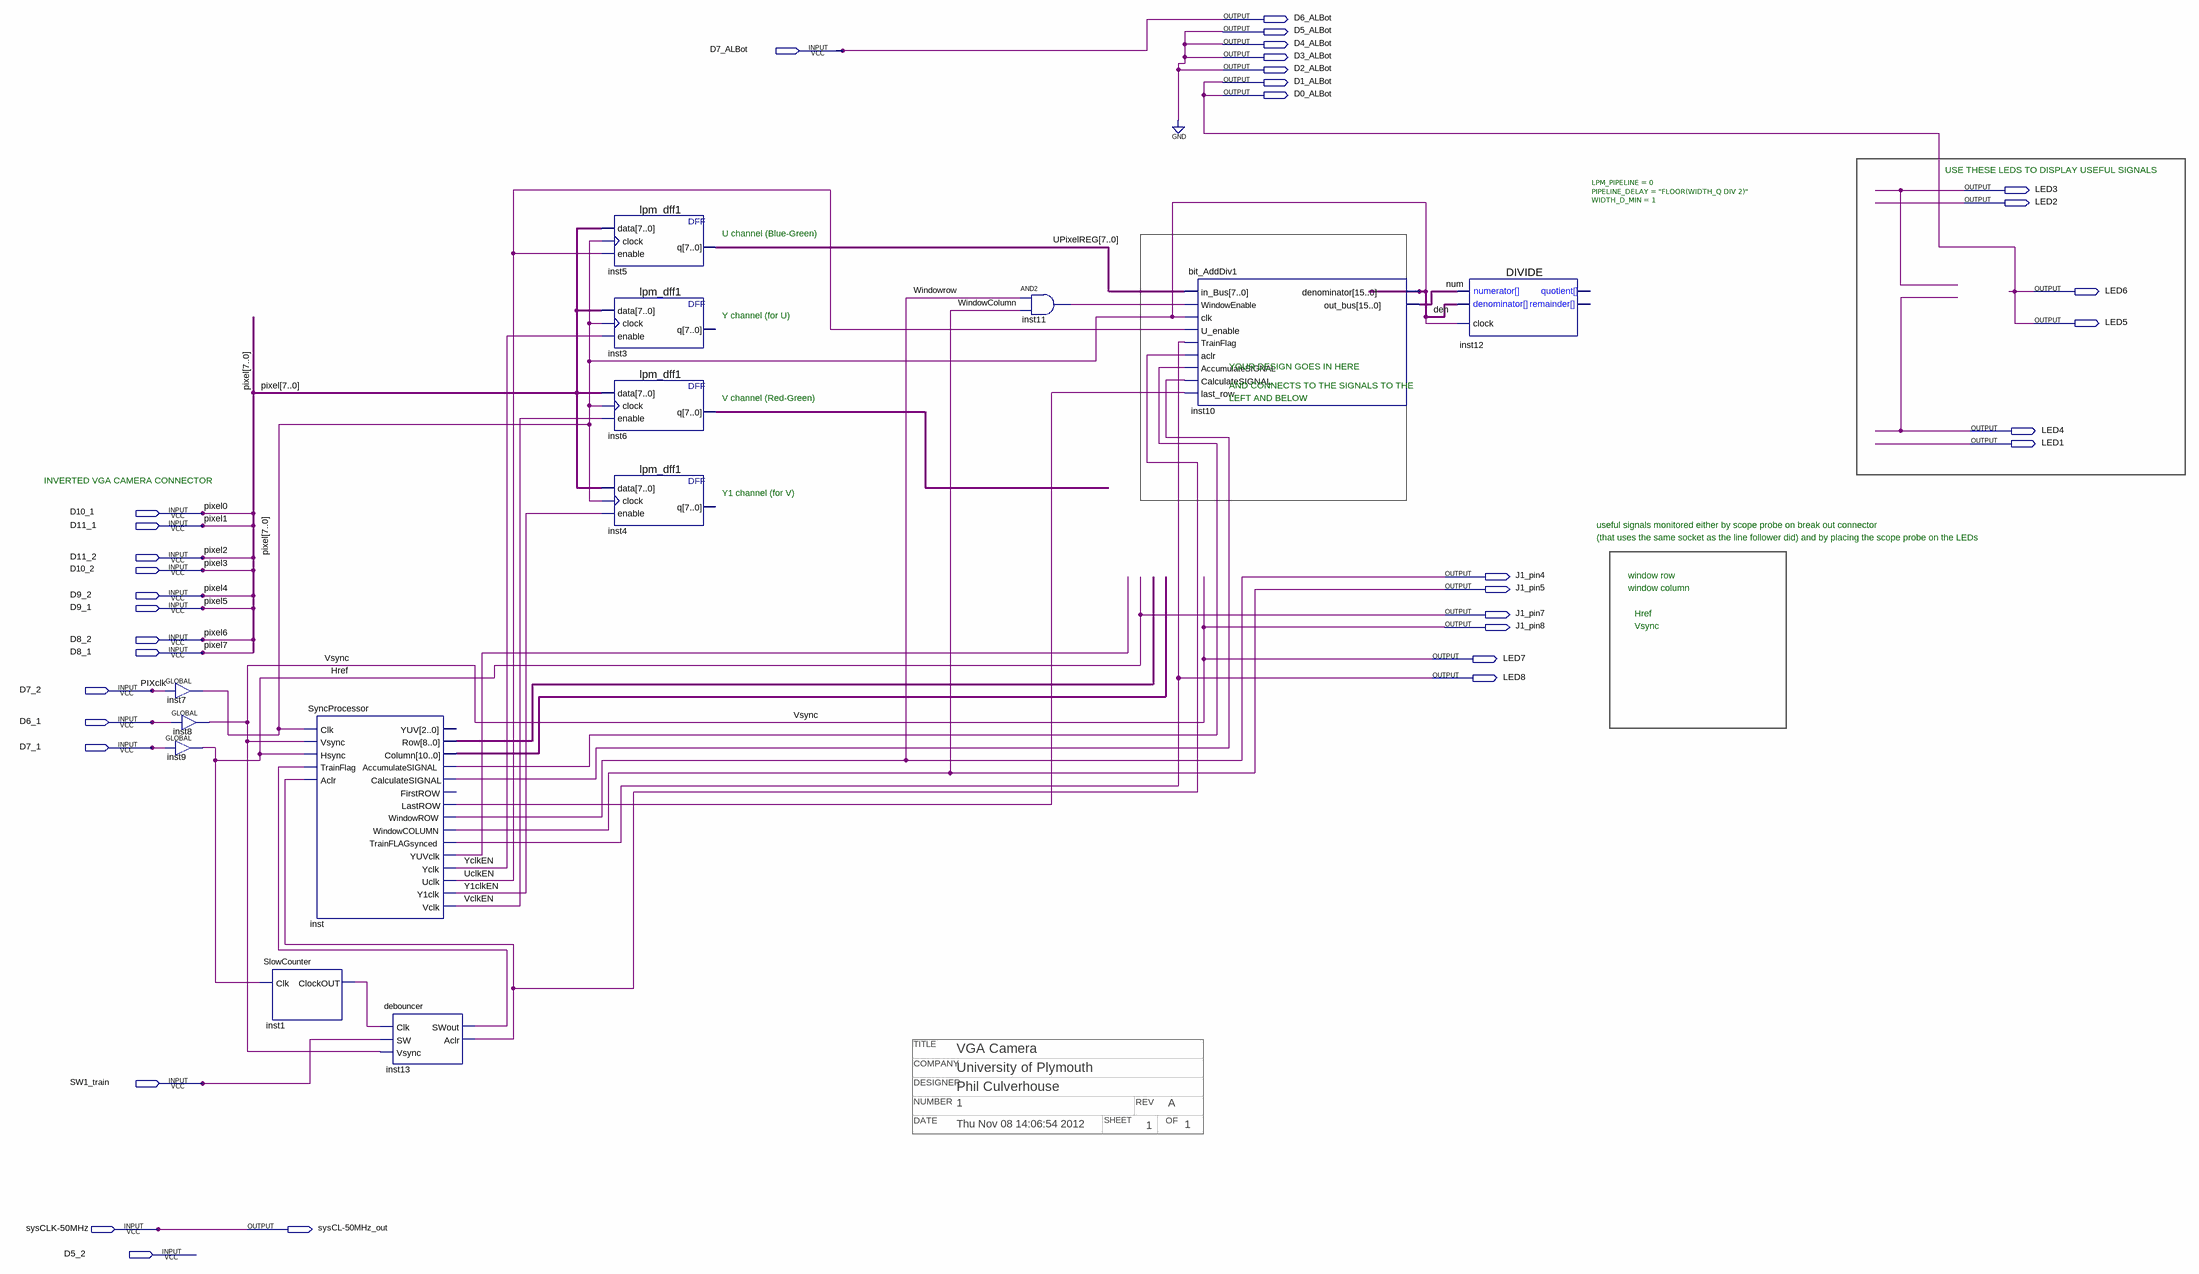
[diagram p0: schematic sheet]
// Quartus schematic VGA-Camera-2006V1.bdf as structural Verilog: 13 symbols, 35 pins
// Title block: TITLE: VGA Camera; COMPANY: University of Plymouth; DESIGNER: Phil Culverhouse; NUMBER: 1; REV: A; DATE: Thu Nov 08 14:06:54 2012; SHEET: 1; OF: 1
module \VGA-Camera-2006V1  (
  input  D7_ALBot,
  input  D10_1,
  input  D11_1,
  input  D11_2,
  input  D10_2,
  input  D9_2,
  input  D9_1,
  input  D8_2,
  input  D8_1,
  input  D7_2,
  input  D6_1,
  input  D7_1,
  input  SW1_train,
  input  \sysCLK-50MHz ,
  input  D5_2,
  output D6_ALBot,
  output D5_ALBot,
  output D4_ALBot,
  output D3_ALBot,
  output D2_ALBot,
  output D1_ALBot,
  output D0_ALBot,
  output LED3,
  output LED2,
  output LED6,
  output LED5,
  output LED4,
  output LED1,
  output J1_pin4,
  output J1_pin5,
  output J1_pin7,
  output J1_pin8,
  output LED7,
  output LED8,
  output \sysCL-50MHz_out 
);

  wire den, inst1_clockout, inst11_out, inst13_aclr, inst13_swout, inst_accumulatesignal,
       inst_calculatesignal, inst_lastrow, inst_yuvclk, num, UclkEN, VclkEN, Y1clkEN, YclkEN;
  wire [7:0] inst6_q, UPixelREG;
  wire [8:0] inst_row;
  wire [10:0] inst_column;

  GLOBAL inst7 (.IN(D7_2), .OUT(den));
  GLOBAL inst8 (.IN(D6_1), .OUT(J1_pin8));
  GLOBAL inst9 (.IN(D7_1), .OUT(J1_pin7));
  SlowCounter inst1 (.Clk(J1_pin7), .ClockOUT(inst1_clockout));
  SyncProcessor inst (
    .Clk(den), .Vsync(J1_pin8), .Hsync(J1_pin7), .TrainFlag(inst13_swout), .Aclr(inst13_aclr),
    .Row(inst_row), .Column(inst_column), .AccumulateSIGNAL(inst_accumulatesignal),
    .CalculateSIGNAL(inst_calculatesignal), .LastROW(inst_lastrow), .WindowROW(J1_pin4),
    .WindowCOLUMN(J1_pin5), .TrainFLAGsynced(LED8), .YUVclk(inst_yuvclk), .Yclk(YclkEN), .Uclk(UclkEN),
    .Y1clk(Y1clkEN), .Vclk(VclkEN));  // open: YUV, FirstROW
  debouncer inst13 (.Clk(inst1_clockout), .SW(SW1_train), .Vsync(J1_pin8), .SWout(inst13_swout), .Aclr(inst13_aclr));
  lpm_dff1 inst5 (
    .data({D8_1, D8_2, D9_1, D9_2, D10_2, D11_2, D11_1, D10_1}), .clock(den), .enable(UclkEN), .q(UPixelREG));
  lpm_dff1 inst3 (
    .data({D8_1, D8_2, D9_1, D9_2, D10_2, D11_2, D11_1, D10_1}), .clock(den), .enable(YclkEN));  // open: q
  lpm_dff1 inst6 (
    .data({D8_1, D8_2, D9_1, D9_2, D10_2, D11_2, D11_1, D10_1}), .clock(den), .enable(VclkEN), .q(inst6_q));
  lpm_dff1 inst4 (
    .data({D8_1, D8_2, D9_1, D9_2, D10_2, D11_2, D11_1, D10_1}), .clock(den), .enable(Y1clkEN));  // open: q
  and inst11 (inst11_out, J1_pin4, J1_pin5);
  bit_AddDiv1 inst10 (
    .in_Bus(UPixelREG), .WindowEnable(inst11_out), .clk(den), .U_enable(UclkEN), .TrainFlag(LED8),
    .aclr(inst13_aclr), .AccumulateSIGNAL(inst_accumulatesignal), .CalculateSIGNAL(inst_calculatesignal),
    .last_row(inst_lastrow), .denominator(den), .out_bus(num));
  DIVIDE #(.LPM_PIPELINE(0), .PIPELINE_DELAY("FLOOR(WIDTH_Q DIV 2)"), .WIDTH_D_MIN(1)) inst12 (
    .clock(den), .numerator(num), .denominator(den));  // open: quotient, remainder

  assign D1_ALBot = D0_ALBot;
  assign D2_ALBot = 1'b0;
  assign D3_ALBot = 1'b0;
  assign D4_ALBot = 1'b0;
  assign D5_ALBot = 1'b0;
  assign D6_ALBot = D7_ALBot;
  assign LED5 = D0_ALBot;
  assign LED6 = D0_ALBot;
  assign LED7 = J1_pin8;
  assign \sysCL-50MHz_out  = \sysCLK-50MHz ;

  // Other names for the same wires on the sheet: PIXclk = D7_2; Href = J1_pin7; WindowColumn = J1_pin5;
  //   Vsync = J1_pin8; pixel[7:0] = {D8_1, D8_2, D9_1, D9_2, D10_2, D11_2, D11_1, D10_1}; pixel0 = D10_1;
  //   pixel1 = D11_1; pixel2 = D11_2; pixel3 = D10_2; pixel4 = D9_2; pixel5 = D9_1; pixel6 = D8_2; pixel7 = D8_1;
  //   Windowrow = J1_pin4

  // Notes on the sheet:
  //   USE THESE LEDS TO DISPLAY USEFUL SIGNALS
  //   U channel (Blue-Green)
  //   Y channel (for U)
  //   YOUR DESIGN GOES IN HERE
  //   AND CONNECTS TO THE SIGNALS TO THE
  //   V channel (Red-Green)
  //   LEFT AND BELOW
  //   INVERTED VGA CAMERA CONNECTOR
  //   Y1 channel (for V)
  //   useful signals monitored either by scope probe on break out connector
  //   (that uses the same socket as the line follower did) and by placing the scope probe on the LEDs
  //   window row
  //   window column
  //   Href
  //   Vsync
endmodule
